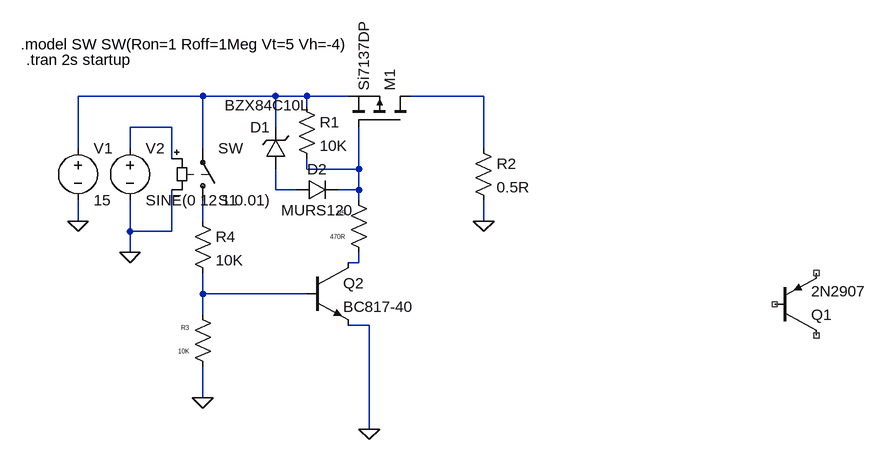
[diagram p0: schematic HighSideSwitch.asc]
HighSideSwitch.asc, the LTspice schematic file:
Version 4
SHEET 1 972 680
WIRE -32 96 -224 96
WIRE 80 96 -32 96
WIRE 128 96 80 96
WIRE 192 96 128 96
WIRE 400 96 288 96
WIRE 128 112 128 96
WIRE -80 144 -144 144
WIRE 80 144 80 96
WIRE -224 176 -224 96
WIRE -144 176 -144 144
WIRE -32 176 -32 96
WIRE 400 176 400 96
WIRE -80 192 -80 144
WIRE 128 208 128 192
WIRE 208 208 208 144
WIRE 208 208 128 208
WIRE 80 240 80 208
WIRE 112 240 80 240
WIRE 208 240 208 208
WIRE 208 240 176 240
WIRE 208 256 208 240
WIRE -224 288 -224 256
WIRE -32 288 -32 256
WIRE 400 288 400 256
WIRE -144 304 -144 256
WIRE -80 304 -80 240
WIRE -80 304 -144 304
WIRE -144 336 -144 304
WIRE 208 352 208 336
WIRE 208 352 192 352
WIRE -32 400 -32 368
WIRE 128 400 -32 400
WIRE -32 432 -32 400
WIRE 224 448 192 448
WIRE -32 560 -32 512
WIRE 224 608 224 448
FLAG 224 608 0
FLAG -144 336 0
FLAG -224 288 0
FLAG -32 560 0
FLAG 400 288 0
SYMBOL pmos 288 144 M270
SYMATTR InstName M1
SYMATTR Value Si7137DP
SYMBOL zener 96 208 R180
WINDOW 0 24 64 Left 2
WINDOW 3 -37 98 Left 2
SYMATTR InstName D1
SYMATTR Value BZX84C10L
SYMBOL res 112 96 R0
SYMATTR InstName R1
SYMATTR Value 10K
SYMBOL diode 112 256 R270
WINDOW 0 32 32 VTop 2
WINDOW 3 0 32 VBottom 2
SYMATTR InstName D2
SYMATTR Value MURS120
SYMATTR Description Zener Diode
SYMATTR Type zener
SYMBOL res 384 160 R0
SYMATTR InstName R2
SYMATTR Value 0.5R
SYMBOL voltage -224 160 R0
SYMATTR InstName V1
SYMATTR Value 15
SYMBOL voltage -144 160 R0
SYMATTR InstName V2
SYMATTR Value SINE(0 12 1 0.01)
SYMBOL res -16 528 R180
WINDOW 0 36 76 Left 0
WINDOW 3 36 40 Left 0
SYMATTR InstName R3
SYMATTR Value 10K
SYMBOL pnp 848 464 M180
SYMATTR InstName Q1
SYMATTR Value 2N2907
SYMBOL npn 128 352 R0
SYMATTR InstName Q2
SYMATTR Value BC817-40
SYMBOL res -48 272 R0
SYMATTR InstName R4
SYMATTR Value 10K
SYMBOL sw -32 272 M180
SYMATTR InstName S1
SYMBOL res 224 352 R180
WINDOW 0 36 76 Left 0
WINDOW 3 36 40 Left 0
SYMATTR InstName R5
SYMATTR Value 470R
TEXT -312 16 Left 2 !.model SW SW(Ron=1 Roff=1Meg Vt=5 Vh=-4)
TEXT -304 40 Left 2 !.tran 2s startup

The netlist it stands for:
* HighSideSwitch.asc
M1 N002 N004 N001 N001 Si7137DP
D1 N005 N001 BZX84C10L
R1 N001 N004 10K
D2 N005 N004 MURS120
R2 N002 0 0.5R
V1 N001 0 15
V2 N003 0 SINE(0 12 1 0.01)
R3 0 N008 10K
Q1 NC_01 NC_02 NC_03 0 2N2907
Q2 N007 N008 0 0 BC817-40
R4 N006 N008 10K
S1 N006 N001 N003 0 SW
R5 N007 N004 470R
.model D D
.lib standard.dio
.model NPN NPN
.model PNP PNP
.lib standard.bjt
.model NMOS NMOS
.model PMOS PMOS
.lib standard.mos
.model SW SW(Ron=1 Roff=1Meg Vt=5 Vh=-4)
.tran 2s startup
.backanno
.end